# EAGLE design SparkFun-74HC4051-8-Channel-Mux-Breakout (EAGLE 7.7.0)
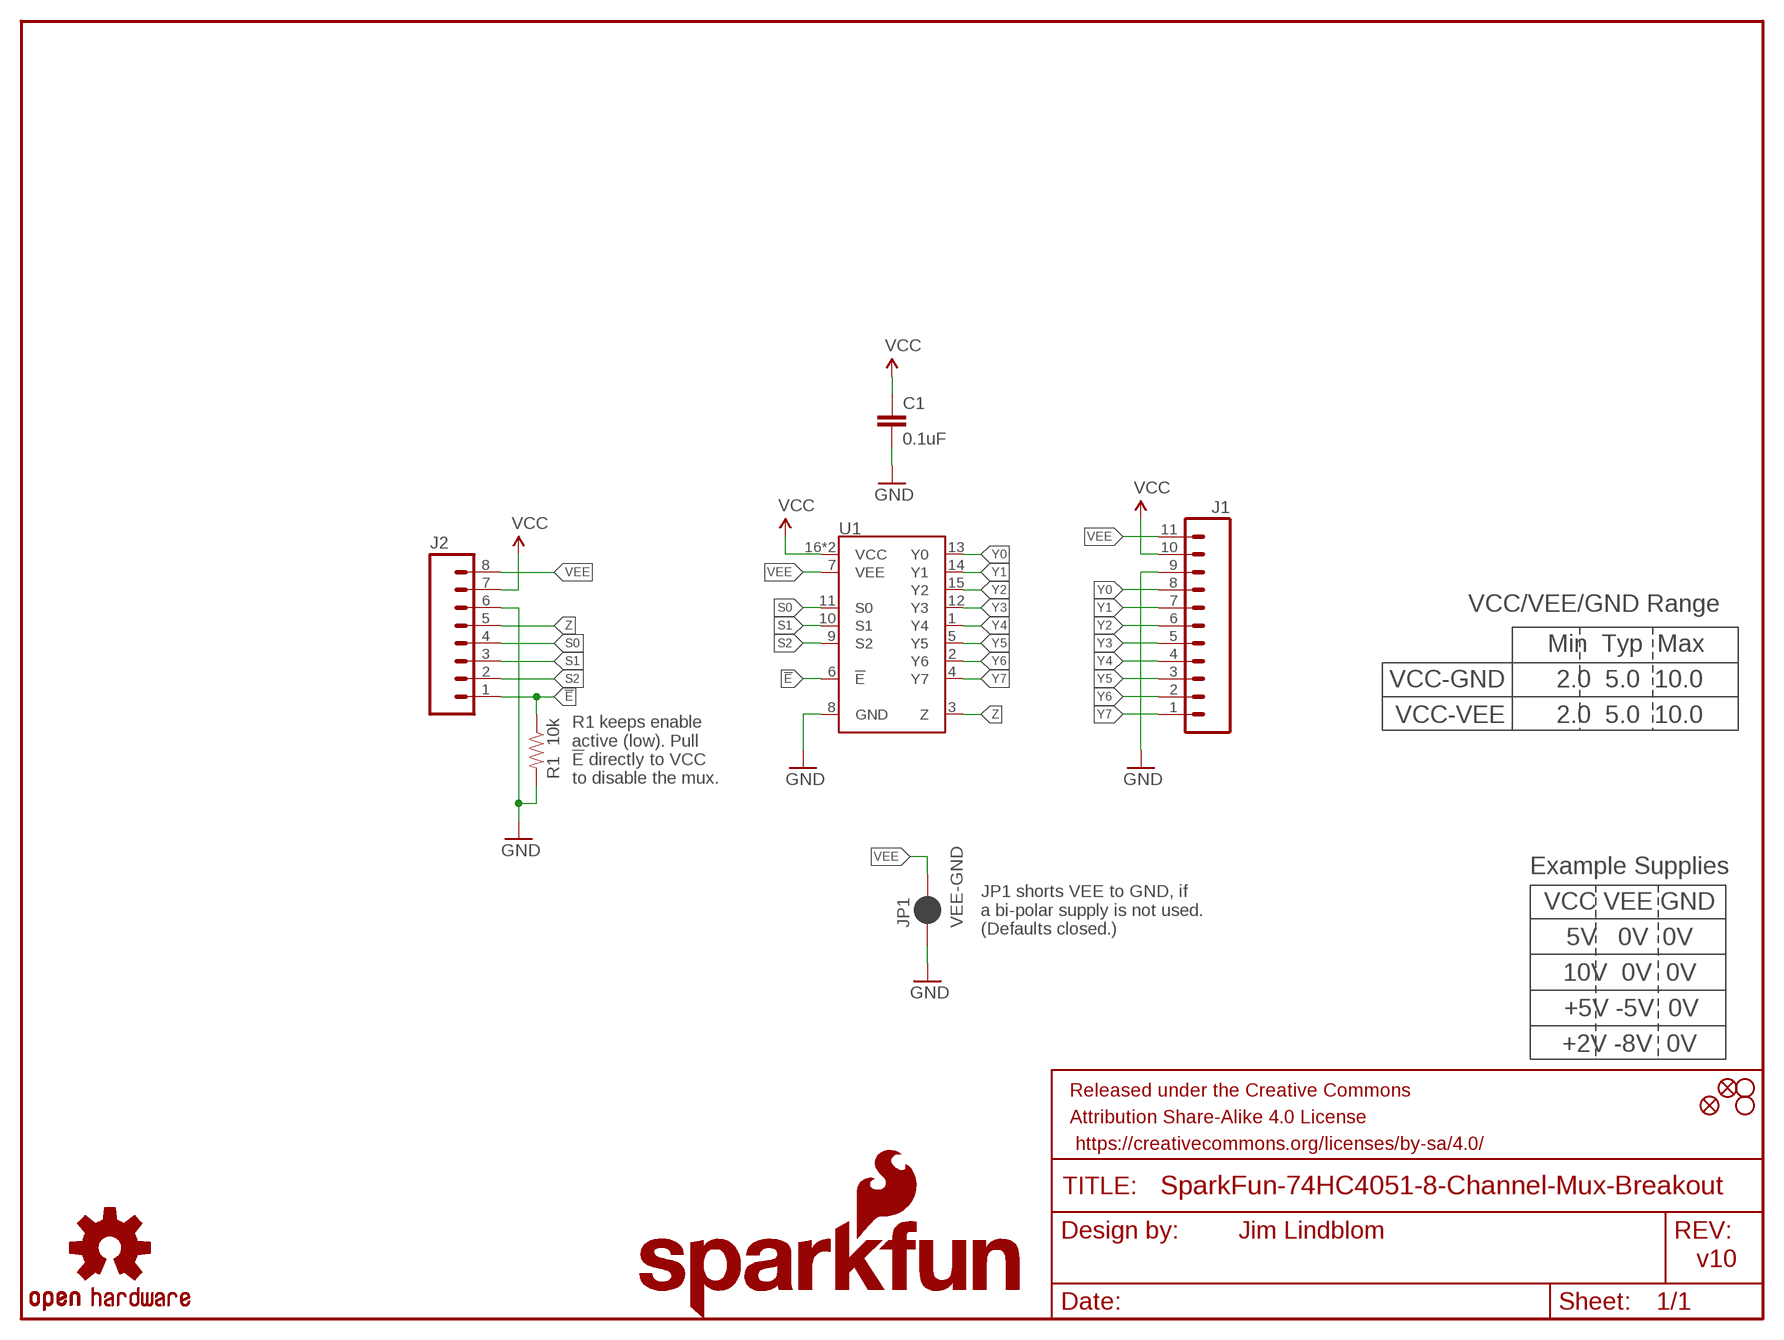
[diagram p0: schematic, sheet 1]

## Parts
C1  0.1uF  0.1UF-0603-25V-(+80/-20%)  [0603]
FD1  FIDUCIAL1X2  [FIDUCIAL-1X2]
FD2  FIDUCIAL1X2  [FIDUCIAL-1X2]
FRAME1  FRAME-LETTER  [CREATIVE_COMMONS]
H1  STAND-OFF  [STAND-OFF]
H2  STAND-OFF  [STAND-OFF]
J1  M11PTH  [1X11]
J2  M08  [1X08_ROUND]
JP1  VEE-GND  JUMPER-PAD-2-NC_BY_PASTENO-SILK  [PAD-JUMPER-2-NC_BY_PASTE_NO_SILK]
LOGO1  SFE_LOGO_FLAME.1_INCH  [SFE_LOGO_FLAME_.1]
LOGO2  OSHW-LOGOMINI  [OSHW-LOGO-MINI]
LOGO3  SFE_LOGO_NAME.1_INCH  [SFE_LOGO_NAME_.1]
R1  10k  10KOHM-0603-1/10W-1%  [0603]
U1  74HC4051BQ  [DHVQFN-16-2.5X3.5MM]

## Nets
!E!: J2.1 R1.1 U1.6(!E!)
GND: C1.2 J1.9 J2.6 JP1.1 R1.2 U1.8(GND)
S0: J2.4 U1.11(S0)
S1: J2.3 U1.10(S1)
S2: J2.2 U1.9(S2)
VCC: C1.1 J1.10 J2.7 U1.16(VCC) U1.EP(VCC)
VEE: J1.11 J2.8 JP1.2 U1.7(VEE)
Y0: J1.8 U1.13(Y0)
Y1: J1.7 U1.14(Y1)
Y2: J1.6 U1.15(Y2)
Y3: J1.5 U1.12(Y3)
Y4: J1.4 U1.1(Y4)
Y5: J1.3 U1.5(Y5)
Y6: J1.2 U1.2(Y6)
Y7: J1.1 U1.4(Y7)
Z: J2.5 U1.3(Z)

## Notes on the sheet
- VCC/VEE/GND Range
- Min  Typ  Max
- VCC-GND | 2.0  5.0  10.0
- VCC-VEE | 2.0  5.0  10.0
- R1 keeps enable 
  active (low). Pull 
  !E! directly to VCC 
  to disable the mux.
- Example Supplies
- VCC VEE GND
- JP1 shorts VEE to GND, if 
  a bi-polar supply is not used.
  (Defaults closed.)
- 5V   0V  0V
- 10V  0V  0V
- +5V -5V  0V
- +2V -8V  0V
- Jim Lindblom
- v10

## Library data of the parts
C1 = SparkFun-Capacitors:0.1UF: 0.1µF ceramic capacitors A capacitor is a passive two-terminal electrical component used to store electrical energy temporarily in an electric field.; PROD_ID: CAP-00810
FD1 FD2 = SparkFun-Aesthetics:FIDUCIAL: Fiducial Alignment Points Various fiducial points for machine vision alignment.
FRAME1 = SparkFun-Aesthetics:FRAME-LETTER: Schematic Frame Standard 8.5x11 US Letter frame
H1 H2 = SparkFun-Electromechanical:STAND-OFF: #4 Stand Off This is the mechanical footprint for a #4 phillips button head screw. Use the keepout ring to avoid running the screw head into surrounding components. SKU : PRT-00447
J1 = SparkFun-Connectors:M11: Header 11 Standard 11-pin 0.1" header. Use with straight break away headers (SKU : PRT-00116), right angle break away headers (PRT-00553), swiss pins (PRT-00743), machine pins (PRT-00117), and female headers (PRT-00115).
J2 = SparkFun-Connectors:M08: Header 8 Standard 8-pin 0.1" header. Use with straight break away headers (SKU : PRT-00116), right angle break away headers (PRT-00553), swiss pins (PRT-00743), machine pins (PRT-00117), and female headers (PRT-00115).; PROD_ID: CONN-08437
JP1 = SparkFun-Passives:JUMPER-PAD-2-NC_BY_PASTE
LOGO1 = SparkFun-Aesthetics:SFE_LOGO_FLAME: SFE Logo, flame only This is the SparkFun flame logo. The logo on the schematic will always be the same size; the package variant is the height of the flame. Default layer for the logo on the board is tSilk.
LOGO2 = SparkFun-Aesthetics:OSHW-LOGO: Open Source Hardware Logo This logo indicates the piece of hardware it is found on incorporates a OSHW license and/or adheres to the definition of open source hardware found here: http://freedomdefined.org/OSHW
LOGO3 = SparkFun-Aesthetics:SFE_LOGO_NAME: SFE Logo, name only This is the SparkFun name logo. The logo on the schematic will always be the same size; the package variant is the height of the flame part of the logo (or the height the flame would be, if it were drawn). Default layer for the logo on the board is tSilk.
R1 = SparkFun-Resistors:10KOHM: 10kΩ resistor A resistor is a passive two-terminal electrical component that implements electrical resistance as a circuit element. Resistors act to reduce current flow, and, at the same time, act to lower voltage levels within circuits.; PROD_ID: RES-00824
U1 = SparkFun-IC-Logic:74*4051: NXP 74HC4051 8-Channel Analog Multiplexer/Demultiplexer The 74HC4051; 74HCT4051 is a single-pole octal-throw analog switch (SP8T) suitable for use in analog or digital 8:1 multiplexer/demultiplexer applications. The switch features three digital select inputs (S0, S1 and S2), eight independent inputs/outputs (Yn), a common input/output (Z) and a digital enable input (E). When E is HIGH, the switches are turned off. Inputs include clamp diodes. This enables the use of current limiting resistors to interface inputs to voltages in excess of VCC. Datasheet <http://www.nxp.com/documents/data_sheet/74HC_HCT4051.pdf>; PROD_ID: IC-13334

## Board
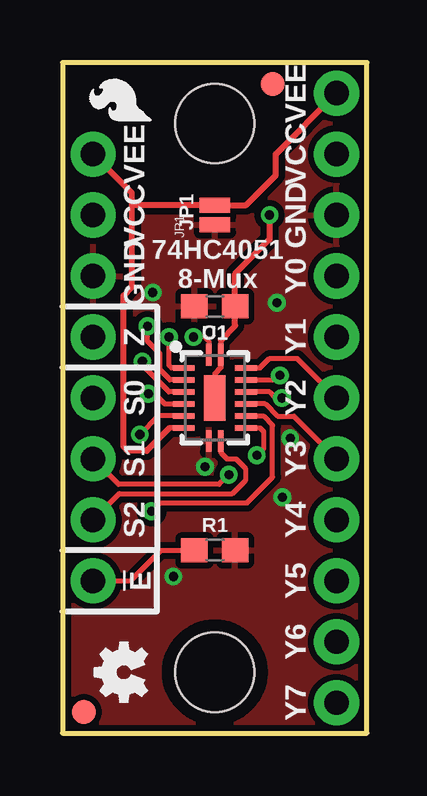
[diagram p1: board, top side]
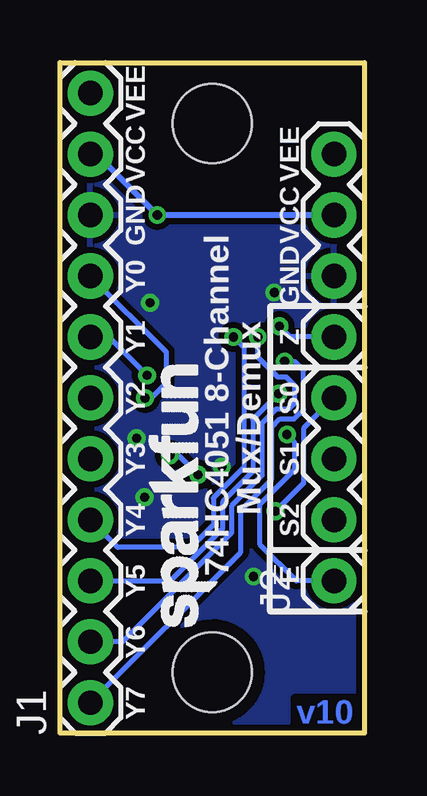
[diagram p2: board, bottom side, seen from below]

Size 12.7 x 27.94 mm. Coordinates in mm from the lower left corner, seen from the top.
Outline: 0,27.94 0,0 12.7,0 12.7,27.94 0,27.94
Copper layers (1*16): Top 0.035mm / dielectric 1.5mm / Bottom 0.035mm
Design rules "SparkFun-2-layer-TIGHT": minimum track width 7mil, minimum drill 15mil, track to track 7mil, track to pad 7mil, pad to pad 7mil, via to via 7mil, smd to smd 7mil, copper to edge 7mil, drill to drill 7mil, minimum pad ring 7mil, minimum via ring 7mil, stop-mask expansion 4mil, vias tented up to drill 25mil, thermal gap 10mil

### Footprints (pad centres in the part's own frame; a part is rotated, then mirrored left to right if it is on the bottom)
0603 = smd 1.1 x 1: 1 -0.85,0; 2 0.85,0
FIDUCIAL-1X2 = smd 1 x 1: 1 0,0
STAND-OFF = hole 3.302: 0,0
1X11 = drill 1.016 pad 1.88: 1 0,0; 2 2.54,0; 3 5.08,0; 4 7.62,0; 5 10.16,0; 6 12.7,0; 7 15.24,0; 8 17.78,0; 9 20.32,0; 10 22.86,0; 11 25.4,0
1X08_ROUND = drill 1.016 pad 1.88: 1 0,0; 2 2.54,0; 3 5.08,0; 4 7.62,0; 5 10.16,0; 6 12.7,0; 7 15.24,0; 8 17.78,0
PAD-JUMPER-2-NC_BY_PASTE_NO_SILK = smd 0.635 x 1.27: 1 -0.401,0; 2 0.413,0
DHVQFN-16-2.5X3.5MM = smd 0.9 x 0.24: 1 -1.8,-0.25; 8 1.8,-0.25; 9 1.8,0.25; 16 -1.8,0.25 | smd 0.24 x 0.9: 2 -1.25,-1.3; 3 -0.75,-1.3; 4 -0.25,-1.3; 5 0.25,-1.3; 6 0.75,-1.3; 7 1.25,-1.3; 10 1.25,1.3; 11 0.75,1.3; 12 0.25,1.3; 13 -0.25,1.3; 14 -0.75,1.3; 15 -1.25,1.3 | smd 1.9 x 0.9: EP 0,0

### Placement (x,y rotation side)
C1  6.35,17.78 180 top
FD1  0.89,0.89 0 top
FD2  8.76,27.05 0 top
FRAME1  -16.51,-22.86 0 top  (outside the outline)
H1  6.35,25.4 0 top
H2  6.35,2.54 0 top
J1  11.43,1.27 90 bottom
J2  1.27,6.35 90 bottom
JP1  6.35,21.59 90 top
LOGO1  4.04,25.22 90 top
LOGO2  2.54,2.54 90 top
LOGO3  5.65,3.94 90 bottom
R1  6.35,7.62 0 top
U1  6.35,13.97 270 top

### Tracks (layer width: path | path; a pad name or v marks a point on that pad's centre or on a via)
!E!  (via drill 0.38)
  Top 0.203: U1.6 4,13.22 v3.23,12.45 | R1.1 4.12,7.62 2.85,6.35 J2.1
  Bottom 0.203: v3.23,12.45 2.92,12.14 2.92,10.97 4.37,9.53 4.37,7.87 2.85,6.35 J2.1
GND  (via drill 0.38)
  other vias: 9.5,12.29 3.76,18.36 8.94,17.93 5.94,11.1 9.17,9.83 4.62,6.53
  pour Top (isolate 0.254): 0,27.94 0,0 12.7,0 12.7,27.94
  pour Bottom (isolate 0.254): 12.7,27.94 12.7,0 0,0 0,27.94
S0  (via drill 0.38)
  Top 0.203: U1.11 8.37,13.22 8.76,12.83 8.76,10.67 7.7,9.6 4.06,9.6 v3.71,9.25
  Bottom 0.203: v3.71,9.25 2.54,10.41 2.54,12.7 J2.4
S1  (via drill 0.38)
  Top 0.203: U1.10 8.23,12.72 8.38,12.57 8.38,11.86 v8.1,11.58 | v6.93,10.77 6.53,10.36 2.34,10.36 J2.3
  Bottom 0.203: v8.1,11.58 7.75,11.58 v6.93,10.77
S2
  Top 0.203: U1.9 6.6,11.69 6.86,11.43 7.24,11.43 7.62,11.05 7.62,10.52 7.09,9.98 2.36,9.98 J2.2
VCC  (via drill 0.38)
  Top 0.203: U1.16
  Top 0.229: U1.EP 6.35,14.99 6.6,15.24 U1.16 | U1.16 6.6,16.38
  Top 0.254: 6.6,16.38 7.2,16.98 C1.1 7.2,19.14 8.64,20.57 v8.64,21.59
  Bottom 0.254: J1.10 11.18,24.13 v8.64,21.59 J2.7
VEE
  Top 0.229: U1.7 4.46,12.72
  Top 0.254: 2.9,22 2.9,18.59 2.54,18.24 2.54,11.94 2.72,11.76 3.5,11.76 4.46,12.72 | 2.9,22 2.9,22.5 J2.8 | 2.9,22 JP1.2 7.65,22 8.89,23.24 8.89,24.13 J1.11
Y0  (via drill 0.38)
  Top 0.203: v9.15,13.97 8.89,13.97 8.64,14.22 U1.13
  Bottom 0.203: v9.15,13.97 8.89,13.97 8.26,14.61 8.26,15.88 J1.8
Y1  (via drill 0.38)
  Top 0.203: U1.14 8.88,14.72 v9.07,14.91
  Bottom 0.203: v9.07,14.91 10.67,16.51 J1.7
Y2
  Top 0.203: U1.15 8.23,15.22 8.64,15.62 9.78,15.62 J1.6
Y3
  Top 0.203: U1.12 8.45,13.72 8.97,13.21 9.65,13.21 J1.5
Y4  (via drill 0.38)
  Top 0.203: v5.46,16.51 5.92,16.51 6.1,16.33 U1.1
  Bottom 0.203: v5.46,16.51 5.03,16.08 5.03,11.07 6.3,9.8 6.3,8.69 7.24,7.75 10.29,7.75 J1.4
Y5  (via drill 0.38)
  Top 0.203: v3.58,14.15 3.83,14.15 4.26,13.72 U1.5
  Bottom 0.203: v3.58,14.15 4.65,13.08 4.65,10.91 5.92,9.64 5.92,8.52 8.09,6.35 J1.3
Y6  (via drill 0.38)
  Top 0.203: v4.45,16.51 4.45,15.32 4.54,15.22 U1.2
  Bottom 0.203: v4.45,16.51 4.45,15.67 3.61,14.83 3.25,14.83 2.92,14.5 2.92,13.75 3.17,13.5 3.68,13.5 4.27,12.92 4.27,10.74 5.54,9.47 5.54,8.36 10.08,3.81 J1.2
Y7  (via drill 0.38)
  Top 0.203: v3.33,15.49 3.33,15.33 4.44,14.22 U1.4
  Bottom 0.203: v3.33,15.49 2.92,15.49 2.54,15.11 2.54,13.49 2.93,13.09 3.52,13.09 3.89,12.72 3.89,10.57 5.16,9.3 5.16,7.54 J1.1
Z  (via drill 0.38)
  Top 0.203: U1.3 4.48,14.72 4.06,15.14 4.06,15.81 3.54,16.33 v3.54,16.95
  Bottom 0.203: v3.54,16.95 3.1,16.51 J2.5

### Text on the board
Bottom: v10
tPlace: VEE | VEE | VCC | VCC | JP1 | GND | 74HC4051 / 8-Mux | GND | Y0 | Z | Y1 | S0 | Y2 | S1 | Y3 | S2 | Y4 | !E! | Y5 | Y6 | Y7
bPlace: VEE | VEE | VCC | VCC | GND | GND | Y0 | Z | Y1 | S0 | Y2 | S1 | Y3 | S2 | Mux/Demux | Y4 | !E! | 74HC4051 8-Channel | Y5 | Y6 | Y7
tDocu: Jim Lindblom